# EAGLE design SpiderHand (EAGLE 9.2.2)
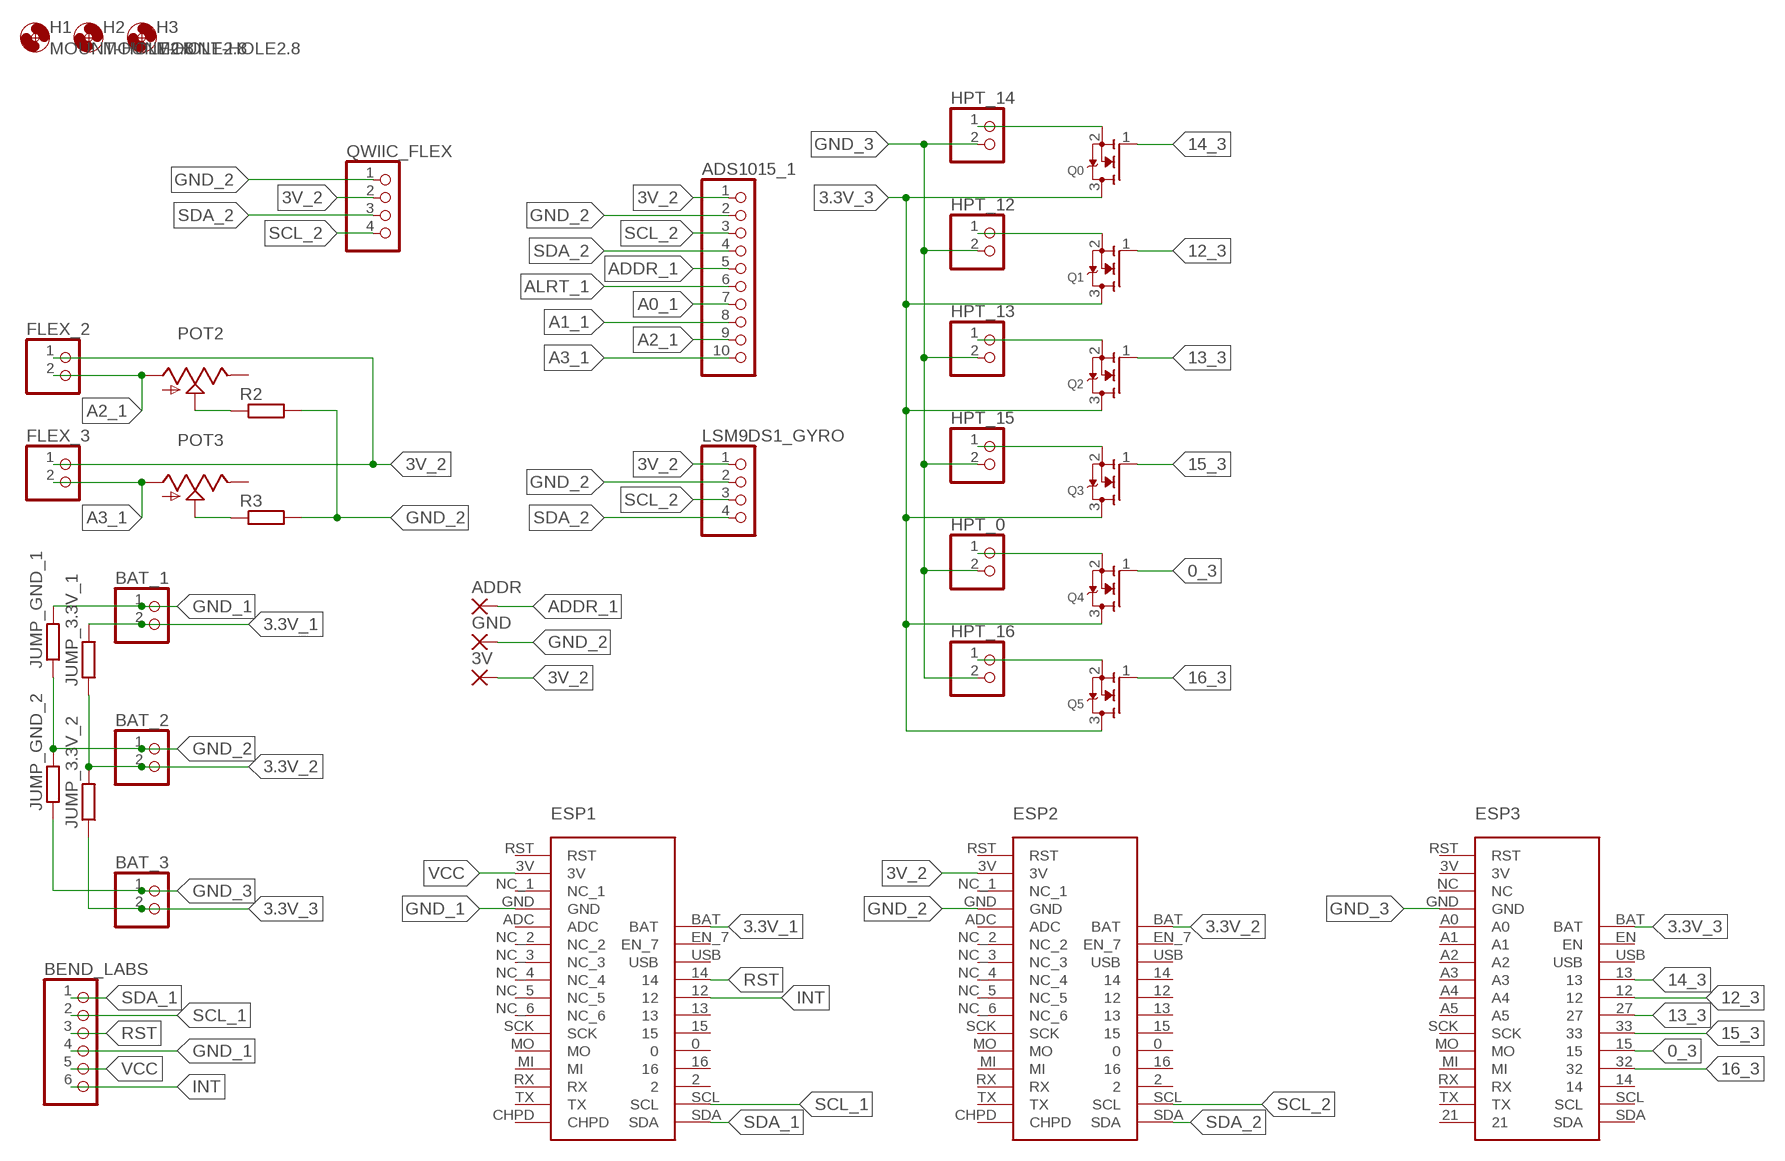
[diagram p0: schematic, sheet 1]

## Parts
3V  SMD2  [SMD1,27-2,54]
ADDR  SMD2  [SMD1,27-2,54]
ADS1015_1  PINHD-1X10  [1X10]
BAT_1  PINHD-1X2  [1X02]
BAT_2  PINHD-1X2  [1X02]
BAT_3  PINHD-1X2  [1X02]
BEND_LABS  PINHD-1X6/90  [1X06/90]
ESP1  ESP_8266_ADAFRUIT  [ESP_8266_ADAFRUIT]
ESP2  ESP_8266_ADAFRUIT  [ESP_8266_ADAFRUIT]
ESP3  ESP_32_ADAFRUIT  [ESP_32_ADAFRUIT]
FLEX_2  PINHD-1X2  [1X02]
FLEX_3  PINHD-1X2  [1X02]
GND  SMD2  [SMD1,27-2,54]
H1  MOUNT-HOLE2.8  [2,8]
H2  MOUNT-HOLE2.8  [2,8]
H3  MOUNT-HOLE2.8  [2,8]
HPT_0  PINHD-1X2  [1X02]
HPT_12  PINHD-1X2  [1X02]
HPT_13  PINHD-1X2  [1X02]
HPT_14  PINHD-1X2  [1X02]
HPT_15  PINHD-1X2  [1X02]
HPT_16  PINHD-1X2  [1X02]
JUMP_3.3V_1  R-EU_M0805  [M0805]
JUMP_3.3V_2  R-EU_M0805  [M0805]
JUMP_GND_1  R-EU_M0805  [M0805]
JUMP_GND_2  R-EU_M0805  [M0805]
LSM9DS1_GYRO  PINHD-1X4/90  [1X04/90]
POT2  TRIM_US-CA6V  [CA6V]
POT3  TRIM_US-CA6V  [CA6V]
Q0  MOSFET-NREFLOW  [SOT23]
Q1  MOSFET-NREFLOW  [SOT23]
Q2  MOSFET-NREFLOW  [SOT23]
Q3  MOSFET-NREFLOW  [SOT23]
Q4  MOSFET-NREFLOW  [SOT23]
Q5  MOSFET-NREFLOW  [SOT23]
QWIIC_FLEX  PINHD-1X4/90  [1X04/90]
R2  R-EU_0204/7  [0204/7]
R3  R-EU_0204/7  [0204/7]

## Nets
0_3: ESP3.15 Q4.1(G)
3.3V_1: BAT_1.2 ESP1.BAT JUMP_3.3V_1.2
3.3V_2: BAT_2.2 ESP2.BAT JUMP_3.3V_1.1 JUMP_3.3V_2.2
3.3V_3: BAT_3.2 ESP3.BAT JUMP_3.3V_2.1 Q0.3(D) Q1.3(D) Q2.3(D) Q3.3(D) Q4.3(D) Q5.3(D)
3V_2: 3V.1(P) ADS1015_1.1 ESP2.3V FLEX_2.1 FLEX_3.1 LSM9DS1_GYRO.1 QWIIC_FLEX.2
12_3: ESP3.12 Q1.1(G)
13_3: ESP3.27 Q2.1(G)
14_3: ESP3.13 Q0.1(G)
15_3: ESP3.33 Q3.1(G)
16_3: ESP3.32 Q5.1(G)
A0_1: ADS1015_1.7
A1_1: ADS1015_1.8
A2_1: ADS1015_1.9 FLEX_2.2 POT2.A
A3_1: ADS1015_1.10 FLEX_3.2 POT3.A
ADDR_1: ADDR.1(P) ADS1015_1.5
ALRT_1: ADS1015_1.6
GND_1: BAT_1.1 BEND_LABS.4 ESP1.GND JUMP_GND_1.2
GND_2: ADS1015_1.2 BAT_2.1 ESP2.GND GND.1(P) JUMP_GND_1.1 JUMP_GND_2.2 LSM9DS1_GYRO.2 QWIIC_FLEX.1 R2.2 R3.2
GND_3: BAT_3.1 ESP3.GND HPT_0.2 HPT_12.2 HPT_13.2 HPT_14.2 HPT_15.2 HPT_16.2 JUMP_GND_2.1
INT: BEND_LABS.6 ESP1.12
N$1: HPT_14.1 Q0.2(S)
N$2: HPT_12.1 Q1.2(S)
N$3: HPT_13.1 Q2.2(S)
N$4: HPT_15.1 Q3.2(S)
N$5: HPT_0.1 Q4.2(S)
N$6: HPT_16.1 Q5.2(S)
N$7: POT2.S R2.1
N$8: POT3.S R3.1
RST: BEND_LABS.3 ESP1.14
SCL_1: BEND_LABS.2 ESP1.SCL
SCL_2: ADS1015_1.3 ESP2.SCL LSM9DS1_GYRO.3 QWIIC_FLEX.4
SDA_1: BEND_LABS.1 ESP1.SDA
SDA_2: ADS1015_1.4 ESP2.SDA LSM9DS1_GYRO.4 QWIIC_FLEX.3
VCC: BEND_LABS.5 ESP1.3V
Unconnected: ESP1.0 ESP1.2 ESP1.13 ESP1.15 ESP1.16 ESP1.ADC ESP1.CHPD ESP1.EN_7 ESP1.MI ESP1.MO ESP1.NC_1 ESP1.NC_2 ESP1.NC_3 ESP1.NC_4 ESP1.NC_5 ESP1.NC_6 ESP1.RST ESP1.RX ESP1.SCK ESP1.TX ESP1.USB ESP2.0 ESP2.2 ESP2.12 ESP2.13 ESP2.14 ESP2.15 ESP2.16 ESP2.ADC ESP2.CHPD ESP2.EN_7 ESP2.MI ESP2.MO ESP2.NC_1 ESP2.NC_2 ESP2.NC_3 ESP2.NC_4 ESP2.NC_5 ESP2.NC_6 ESP2.RST ESP2.RX ESP2.SCK ESP2.TX ESP2.USB ESP3.3V ESP3.14 ESP3.21 ESP3.A0 ESP3.A1 ESP3.A2 ESP3.A3 ESP3.A4 ESP3.A5 ESP3.EN ESP3.MI ESP3.MO ESP3.NC ESP3.RST ESP3.RX ESP3.SCK ESP3.SCL ESP3.SDA ESP3.TX ESP3.USB POT2.E POT3.E

## Library data of the parts
3V ADDR GND = wirepad:SMD2: SMD PAD
ADS1015_1 = pinhead:PINHD-1X10: PIN HEADER
BAT_1 BAT_2 FLEX_2 FLEX_3 HPT_0 HPT_12-HPT_16 = pinhead:PINHD-1X2: PIN HEADER
BAT_3 = pinhead:PINHD-1X2: PIN HEADER; SPICEPREFIX: B
BEND_LABS = pinhead:PINHD-1X6: PIN HEADER
ESP1 ESP2 = ESP_ADAFRUIT:ESP_8266_ADAFRUIT
ESP3 = ESP_ADAFRUIT:ESP_32_ADAFRUIT
H1-H3 = holes:MOUNT-HOLE: MOUNTING HOLE with drill center marker
JUMP_3.3V_1 JUMP_3.3V_2 JUMP_GND_1 JUMP_GND_2 R2 R3 = rcl:R-EU_: RESISTOR, European symbol; SPICEPREFIX: R
LSM9DS1_GYRO QWIIC_FLEX = pinhead:PINHD-1X4: PIN HEADER
POT2 POT3 = pot:TRIM_US-: POTENTIOMETER
Q0 Q1-Q5 = adafruit:MOSFET-N: N-Channel Mosfet 2N7002E - 60V 260mA SOT23 [Digikey: 2N7002ET1GOSTR-ND] - REEL BSH103 - 30V 850mA SOT23 [Digikey: 568-5013-1-ND]

## Board
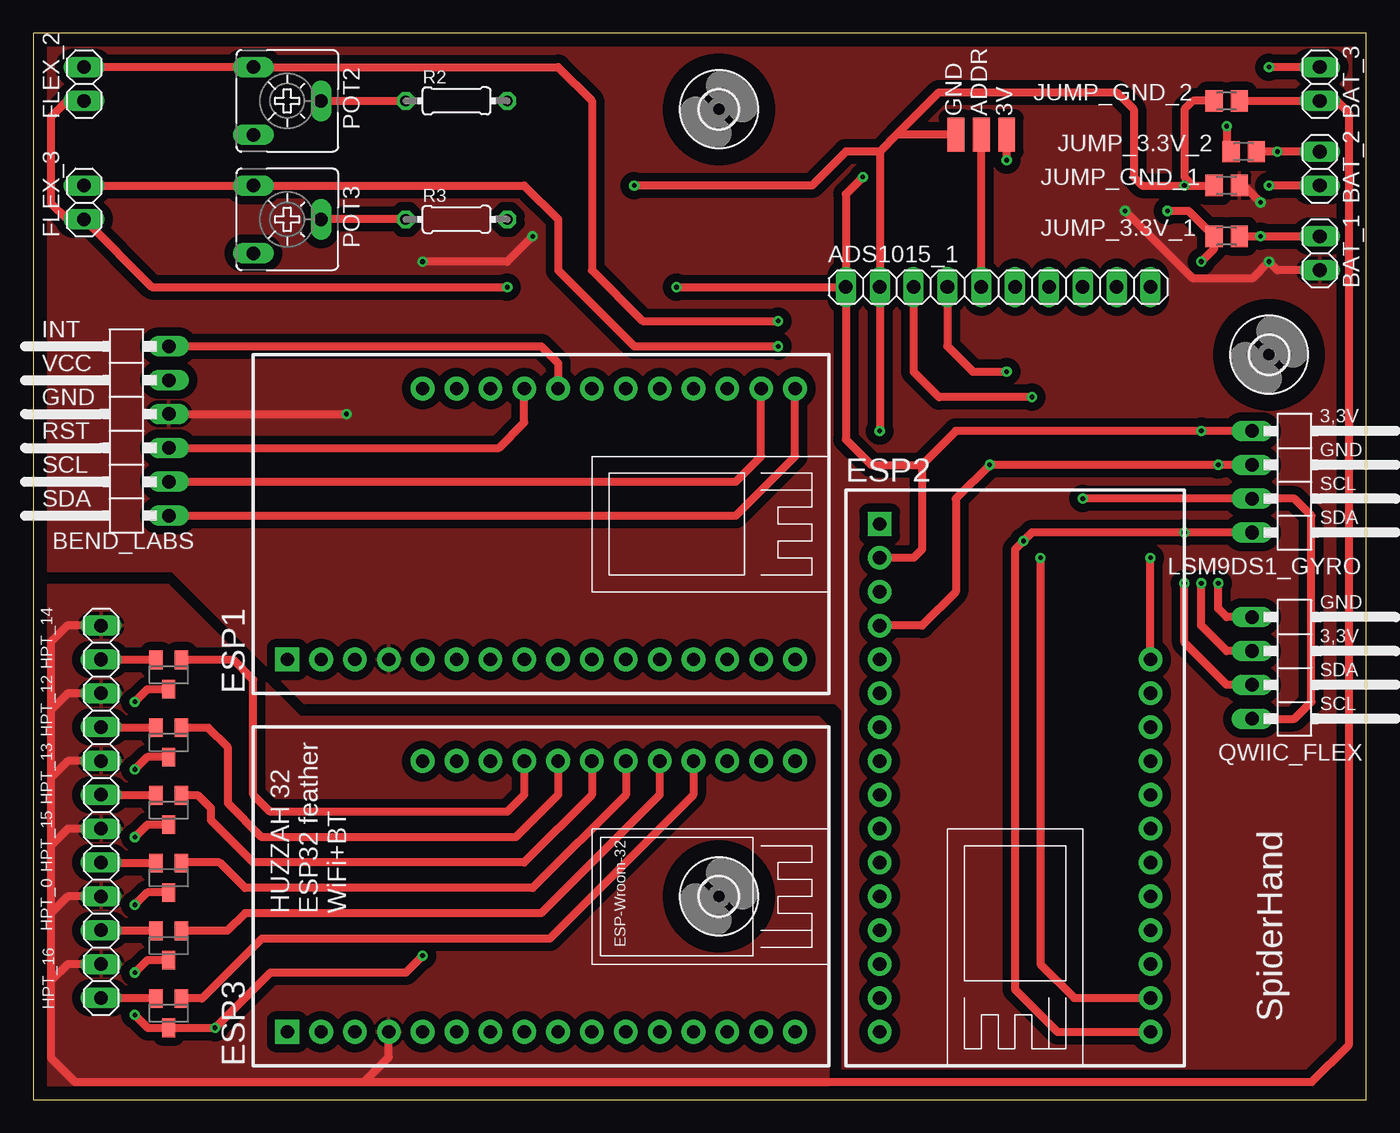
[diagram p1: board, top side]
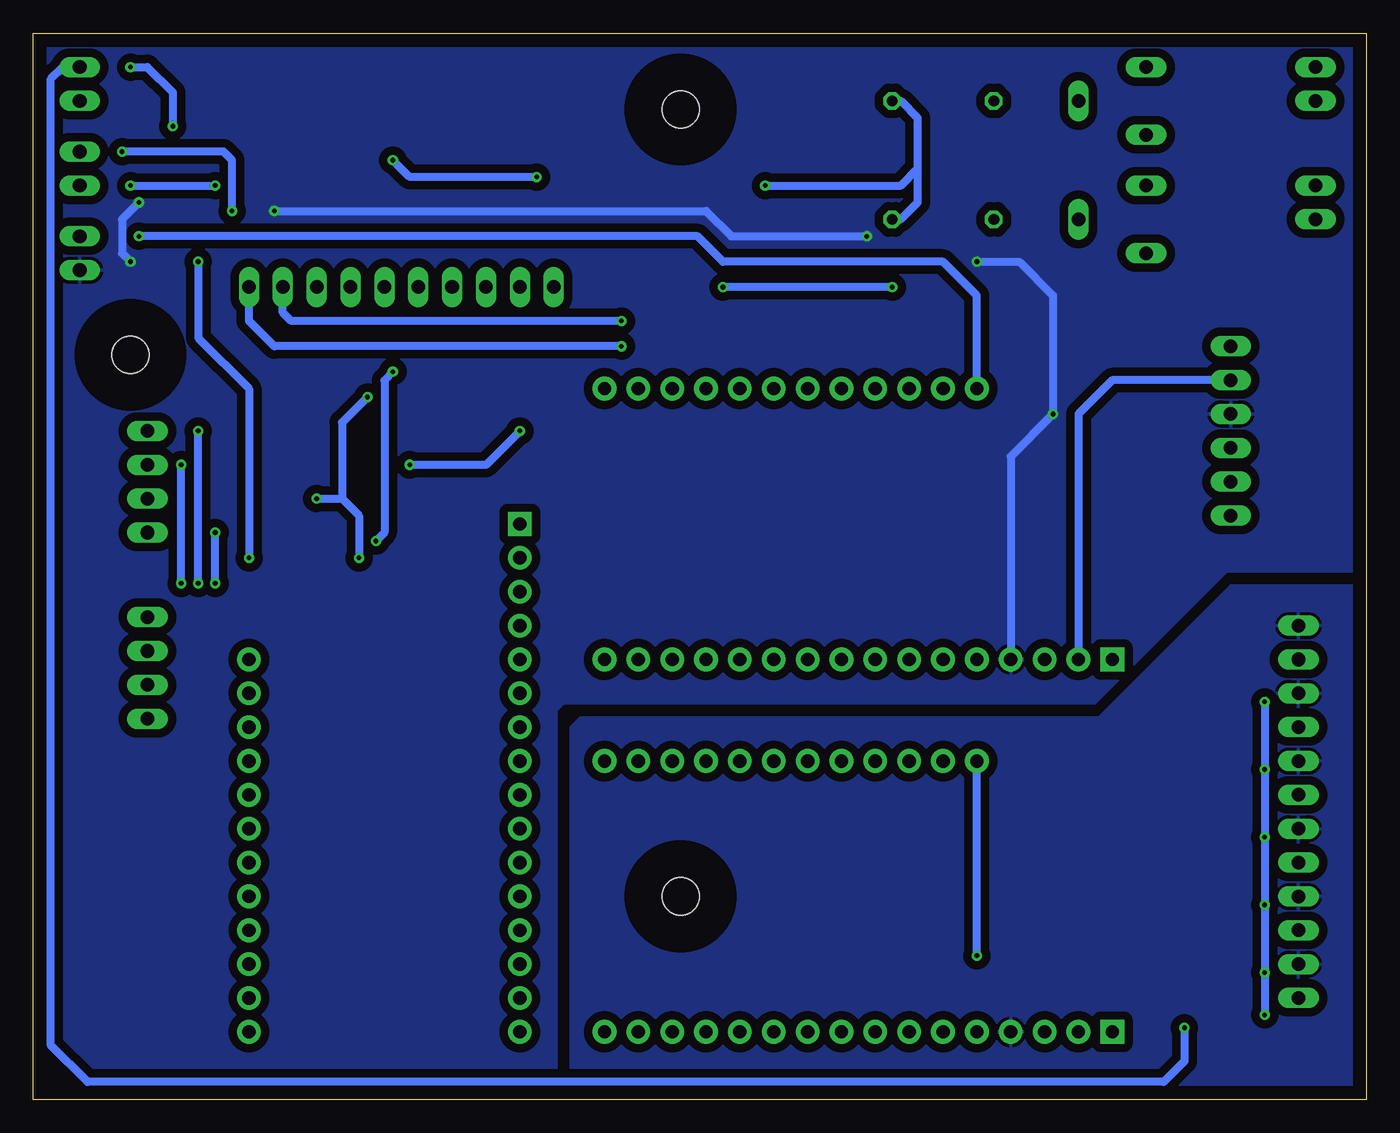
[diagram p2: board, bottom side, seen from below]

Size 100 x 80 mm. Coordinates in mm from the lower left corner, seen from the top.
Outline: 0,0 100,0 100,80 0,80 0,0
Copper layers (1*16): Top 0.035mm / dielectric 1.5mm / Bottom 0.035mm
Design rules "default": minimum track width 6mil, minimum drill 0.35mm, track to track 6mil, track to pad 6mil, pad to pad 6mil, via to via 6mil, smd to smd 6mil, copper to edge 40mil, drill to drill 6mil, minimum pad ring 10mil, minimum via ring 8mil, stop-mask expansion 4mil, vias tented up to drill 0mil, thermal gap 10mil

### Footprints (pad centres in the part's own frame; a part is rotated, then mirrored left to right if it is on the bottom)
SMD1,27-2,54 = smd 1.27 x 2.54: 1 0,0
1X10 = drill 1.016 long: 1 -11.43,0; 2 -8.89,0; 3 -6.35,0; 4 -3.81,0; 5 -1.27,0; 6 1.27,0; 7 3.81,0; 8 6.35,0; 9 8.89,0; 10 11.43,0
1X02 = drill 1.016 long: 1 -1.27,0; 2 1.27,0
1X06/90 = drill 1.016 long: 1 -6.35,-3.81; 2 -3.81,-3.81; 3 -1.27,-3.81; 4 1.27,-3.81; 5 3.81,-3.81; 6 6.35,-3.81
ESP_8266_ADAFRUIT = drill 1 pad 1.778: 0 10.16,-10.16; 2 10.16,-15.24; 3V -10.16,15.24; 12 10.16,-2.54; 13 10.16,-5.08; 14 10.16,0; 15 10.16,-7.62; 16 10.16,-12.7; ADC -10.16,7.62; BAT 10.16,7.62; CHPD -10.16,-20.32; EN_7 10.16,5.08; GND -10.16,10.16; MI -10.16,-12.7; MO -10.16,-10.16; NC_1 -10.16,12.7; NC_2 -10.16,5.08; NC_3 -10.16,2.54; NC_4 -10.16,0; NC_5 -10.16,-2.54; NC_6 -10.16,-5.08; RX -10.16,-15.24; SCK -10.16,-7.62; SCL 10.16,-17.78; SDA 10.16,-20.32; TX -10.16,-17.78; USB 10.16,2.54 | drill 1 pad 1.778 square: RST -10.16,17.78
ESP_32_ADAFRUIT = drill 1 pad 1.778: 3V -10.16,15.24; 12 10.16,-2.54; 13 10.16,0; 14 10.16,-15.24; 15 10.16,-10.16; 21 -10.16,-20.32; 27 10.16,-5.08; 32 10.16,-12.7; 33 10.16,-7.62; A0 -10.16,7.62; A1 -10.16,5.08; A2 -10.16,2.54; A3 -10.16,0; A4 -10.16,-2.54; A5 -10.16,-5.08; BAT 10.16,7.62; EN 10.16,5.08; GND -10.16,10.16; MI -10.16,-12.7; MO -10.16,-10.16; NC -10.16,12.7; RX -10.16,-15.24; SCK -10.16,-7.62; SCL 10.16,-17.78; SDA 10.16,-20.32; TX -10.16,-17.78; USB 10.16,2.54 | drill 1 pad 1.778 square: RST -10.16,17.78
2,8 = hole 2.8: 0,0
M0805 = smd 1.3 x 1.6: 1 -0.95,0; 2 0.95,0
1X04/90 = drill 1.016 long: 1 -3.81,-3.81; 2 -1.27,-3.81; 3 1.27,-3.81; 4 3.81,-3.81
CA6V = drill 1.016 long: A -2.54,-2.54; E 2.54,-2.54; S 0,2.54
SOT23 = smd 1 x 1.4: 1 -0.95,-1.1; 2 0.95,-1.1; 3 0,1.1
0204/7 = drill 0.813 octagon: 1 -3.81,0; 2 3.81,0

### Placement (x,y rotation side)
3V  73.03,72.39 0 top
ADDR  71.12,72.39 0 top
ADS1015_1  72.39,60.96 0 top
BAT_1  96.52,63.5 90 top
BAT_2  96.52,69.85 90 top
BAT_3  96.52,76.2 90 top
BEND_LABS  6.35,50.16 90 top
ESP1  36.83,43.18 90 top
ESP2  73.66,25.4 0 top
ESP3  36.83,15.24 90 top
FLEX_2  3.81,76.2 90 top
FLEX_3  3.81,67.31 90 top
GND  69.22,72.39 0 top
H1  51.44,74.3 0 top
H2  51.44,15.24 0 top
H3  92.71,55.88 0 top
HPT_0  5.08,13.97 90 top
HPT_12  5.08,29.21 90 top
HPT_13  5.08,24.13 90 top
HPT_14  5.08,34.29 90 top
HPT_15  5.08,19.05 90 top
HPT_16  5.08,8.89 90 top
JUMP_3.3V_1  89.53,64.77 0 top
JUMP_3.3V_2  90.81,71.12 0 top
JUMP_GND_1  89.53,68.58 0 top
JUMP_GND_2  89.53,74.93 180 top
LSM9DS1_GYRO  95.25,46.35 270 top
POT2  19.05,74.93 270 top
POT3  19.05,66.04 270 top
Q0  10.16,31.88 180 top
Q1  10.16,26.8 180 top
Q2  10.16,21.72 180 top
Q3  10.16,16.64 180 top
Q4  10.16,11.56 180 top
Q5  10.16,6.48 180 top
QWIIC_FLEX  95.25,32.38 270 top
R2  31.75,74.93 0 top
R3  31.75,66.04 0 top

### Tracks (layer width: path | path; a pad name or v marks a point on that pad's centre or on a via)
0_3
  Top 0.61: ESP3.15 46.99,22.86 38.1,13.97 15.88,13.97 14.56,12.66 Q4.1
3.3V_1  (via drill 0.35)
  Top 0.61: JUMP_3.3V_1.2 v92.08,64.77 BAT_1.2
  Bottom 0.61: ESP1.BAT 29.21,60.33 31.75,62.87 48.26,62.87 50.16,64.77 v92.08,64.77
3.3V_2  (via drill 0.35)
  Top 0.61: BAT_2.2 v93.34,71.12 JUMP_3.3V_2.2 | v85.09,66.67 86.68,66.67 JUMP_3.3V_1.1 88.58,63.82 v87.63,62.87 | ESP2.BAT v83.82,40.64
  Bottom 0.61: v85.09,66.67 85.09,70.48 85.72,71.12 v93.34,71.12 | v87.63,62.87 87.63,57.15 83.82,53.34 v83.82,40.64
3.3V_3  (via drill 0.35)
  Top 0.61: Q0.3 8.55,30.78 v7.62,29.84 | v7.62,6.35 8.59,5.38 Q5.3 v13.63,5.38 17.78,9.53 27.94,9.53 v29.21,10.79 | Q1.3 8.55,25.7 v7.62,24.77 | Q2.3 8.55,20.62 v7.62,19.68 | Q3.3 8.55,15.54 v7.62,14.61 | Q4.3 8.55,10.46 v7.62,9.53 | BAT_3.2 v92.71,77.47 | v89.53,73.03 89.53,71.44 JUMP_3.3V_2.1
  Bottom 0.61: v7.62,29.84 v7.62,24.77 v7.62,19.68 v7.62,14.61 v7.62,9.53 v7.62,6.35 | v29.21,10.79 ESP3.BAT | v13.63,5.38 13.63,2.88 15.19,1.32 95.94,1.32 98.68,4.06 98.68,76.58 97.79,77.47 BAT_3.2 | v92.71,77.47 91.44,77.47 89.53,75.56 v89.53,73.03
3V_2  (via drill 0.35)
  Top 0.61: LSM9DS1_GYRO.1 v87.63,50.16 69.22,50.16 66.67,47.62 | 66.67,47.62 66.67,41.27 66.04,40.64 ESP2.3V | QWIIC_FLEX.2 89.53,33.66 87.63,35.56 v87.63,38.73 | ADS1015_1.1 60.96,49.53 62.87,47.62 66.67,47.62 | FLEX_2.1 2.54,74.93 1.32,73.71 1.32,67.26 2.54,66.04 FLEX_3.1 8.89,60.96 v35.56,60.96 | v48.26,60.96 ADS1015_1.1 | v62.23,69.22 60.96,67.94 ADS1015_1.1 | v73.03,70.48 3V.1
  Bottom 0.61: v87.63,38.73 v87.63,50.16 | v35.56,60.96 v48.26,60.96 | v62.23,69.22 71.75,69.22 v73.03,70.48
12_3
  Top 0.61: ESP3.12 39.37,22.86 36.2,19.68 17.14,19.68 14.61,22.23 14.61,26.42 13.12,27.9 Q1.1
13_3
  Top 0.61: ESP3.27 41.91,22.86 36.83,17.78 16.51,17.78 13.34,20.95 13.34,21.84 12.36,22.82 Q2.1
14_3
  Top 0.61: ESP3.13 36.83,22.86 35.56,21.59 17.78,21.59 16.51,22.86 16.51,31.5 15.03,32.98 Q0.1
15_3
  Top 0.61: ESP3.33 44.45,22.86 37.47,15.88 15.88,15.88 13.97,17.78 11.15,17.78 Q3.1
16_3
  Top 0.61: ESP3.32 49.53,22.86 38.73,12.06 17.14,12.06 12.66,7.58 Q5.1
A2_1  (via drill 0.35)
  Top 0.61: FLEX_2.2 POT2.A 39.37,77.47 41.91,74.93 41.91,62.23 45.72,58.42 v55.88,58.42
  Bottom 0.61: v55.88,58.42 80.64,58.42 81.28,59.05 ADS1015_1.9
A3_1  (via drill 0.35)
  Top 0.61: FLEX_3.2 POT3.A 36.83,68.58 39.37,66.04 39.37,62.23 45.09,56.52 v55.88,56.52
  Bottom 0.61: v55.88,56.52 81.92,56.52 83.82,58.42 ADS1015_1.10
ADDR_1
  Top 0.61: ADS1015_1.5 ADDR.1
GND_1  (via drill 0.35)
  Top 0.61: BEND_LABS.4 v23.5,51.44 | BAT_1.1 93.34,62.23 v92.71,62.87 91.44,61.59 87,61.59 v81.92,66.67 | v92.08,67.31 90.81,68.58 JUMP_GND_1.2 | v37.47,64.77 35.56,62.87 v29.21,62.87
  Bottom 0.61: ESP1.GND 26.67,48.26 v23.5,51.44 23.5,60.33 26.04,62.87 v29.21,62.87 | v92.71,62.87 93.34,63.5 93.34,66.04 v92.08,67.31 | v37.47,64.77 47.62,64.77 49.53,66.67 v81.92,66.67
  pour Top (isolate 0.635): -1.52,39.62 -1.52,80.52 103.63,80.52 103.63,-2.03 60.71,-2.03 60.71,29.21 60.2,29.72 20.32,29.72 10.41,39.62
  pour Bottom (isolate 0.635): -1.52,39.62 -1.52,80.52 103.63,80.52 103.63,-2.03 60.71,-2.03 60.71,29.21 60.2,29.72 20.32,29.72 10.41,39.62
GND_2  (via drill 0.35)
  Top 0.61: LSM9DS1_GYRO.2 v88.9,47.62 v71.75,47.62 69.22,45.09 69.22,38.1 66.67,35.56 ESP2.GND | QWIIC_FLEX.1 89.53,36.2 88.9,36.83 v88.9,38.73 | v63.5,50.16 ADS1015_1.2 63.5,71.12 | GND.1 64.77,72.39 | 64.77,72.39 63.5,71.12 | 87,68.58 v86.36,68.58 83.19,68.58 82.55,69.22 82.55,74.3 81.28,75.56 67.94,75.56 64.77,72.39 | 87,68.58 JUMP_GND_1.1 | BAT_2.1 v92.71,68.58 | JUMP_GND_2.2 87,74.93 86.36,74.3 86.36,69.22 87,68.58 | 63.5,71.12 60.96,71.12 58.42,68.58 v45.09,68.58
  Bottom 0.61: v88.9,38.73 v88.9,47.62 | v63.5,50.16 66.04,47.62 v71.75,47.62 | R2.2 34.92,74.93 33.66,73.66 33.66,69.85 | 33.66,69.85 33.66,67.31 34.92,66.04 R3.2 | v92.71,68.58 v86.36,68.58 | v45.09,68.58 34.92,68.58 33.66,69.85
GND_3
  Top 0.61: HPT_14.2 2.54,35.56 1.32,34.34 1.32,29.21 | 24.82,1.32 26.67,3.17 ESP3.GND | 1.32,29.21 1.32,24.13 | 1.32,24.13 1.32,19.05 | 1.32,19.05 1.32,13.97 | 1.32,13.97 1.32,8.89 | 1.32,8.89 1.32,3.12 3.12,1.32 24.82,1.32 | HPT_12.2 2.59,30.48 1.32,29.21 | HPT_13.2 2.59,25.4 1.32,24.13 | HPT_15.2 2.59,20.32 1.32,19.05 | HPT_0.2 2.59,15.24 1.32,13.97 | HPT_16.2 2.59,10.16 1.32,8.89 | 24.82,1.32 95.94,1.32 98.68,4.06 98.68,74.04 97.79,74.93 BAT_3.1 JUMP_GND_2.1
  pour Top (isolate 0.635): -1.52,38.61 -1.52,-2.03 59.69,-2.03 59.69,27.94 58.93,28.7 20.07,28.7 10.16,38.61
  pour Bottom (isolate 0.635): -1.52,38.61 -1.52,-2.03 59.69,-2.03 59.69,27.94 58.93,28.7 20.07,28.7 10.16,38.61
INT
  Top 0.61: BEND_LABS.6 38.1,56.52 39.37,55.24 ESP1.12
N$1
  Top 0.61: Q0.2 5.12,32.98 HPT_14.1
N$2
  Top 0.61: Q1.2 5.12,27.9 HPT_12.1
N$3
  Top 0.61: Q2.2 5.12,22.82 HPT_13.1
N$4
  Top 0.61: Q3.2 5.12,17.74 HPT_15.1
N$5
  Top 0.61: Q4.2 5.12,12.66 HPT_0.1
N$6
  Top 0.61: Q5.2 5.12,7.58 HPT_16.1
N$7
  Top 0.61: POT2.S R2.1
N$8
  Top 0.61: R3.1 POT3.S
RST
  Top 0.61: BEND_LABS.3 34.92,48.9 36.83,50.8 ESP1.14
SCL_1
  Top 0.61: BEND_LABS.2 52.7,46.35 54.61,48.26 ESP1.SCL
SCL_2  (via drill 0.35)
  Top 0.61: v78.74,45.09 LSM9DS1_GYRO.3 94.61,45.09 95.89,43.81 95.89,29.84 94.61,28.57 QWIIC_FLEX.4 | v75.56,40.64 75.56,10.16 78.11,7.62 ESP2.SCL | ADS1015_1.3 66.04,54.61 67.94,52.7 v74.93,52.7
  Bottom 0.61: v78.74,45.09 76.83,45.09 | 76.83,45.09 75.56,43.81 v75.56,40.64 | v74.93,52.7 76.83,50.8 76.83,45.09
SDA_1
  Top 0.61: BEND_LABS.1 52.7,43.81 57.15,48.26 ESP1.SDA
SDA_2  (via drill 0.35)
  Top 0.61: LSM9DS1_GYRO.4 v86.36,42.55 74.93,42.55 v74.3,41.91 73.66,41.27 73.66,8.26 76.83,5.08 ESP2.SDA | QWIIC_FLEX.3 89.53,31.11 86.36,34.29 v86.36,38.73 | ADS1015_1.4 68.58,56.52 70.48,54.61 v73.03,54.61
  Bottom 0.61: v86.36,38.73 v86.36,42.55 | v73.03,54.61 73.66,53.98 73.66,42.55 v74.3,41.91
VCC
  Bottom 0.61: BEND_LABS.5 19.05,53.98 21.59,51.44 ESP1.3V

### Text on the board
tNames: INT | VCC | GND | 3,3V | RST | GND | SCL | SCL | SDA | SDA | GND | 3,3V | SDA | SCL | SpiderHand